# EAGLE schematic Low.Noise.Current.Source.bkup (EAGLE 7.2.0)

## Sheet 1 of 3
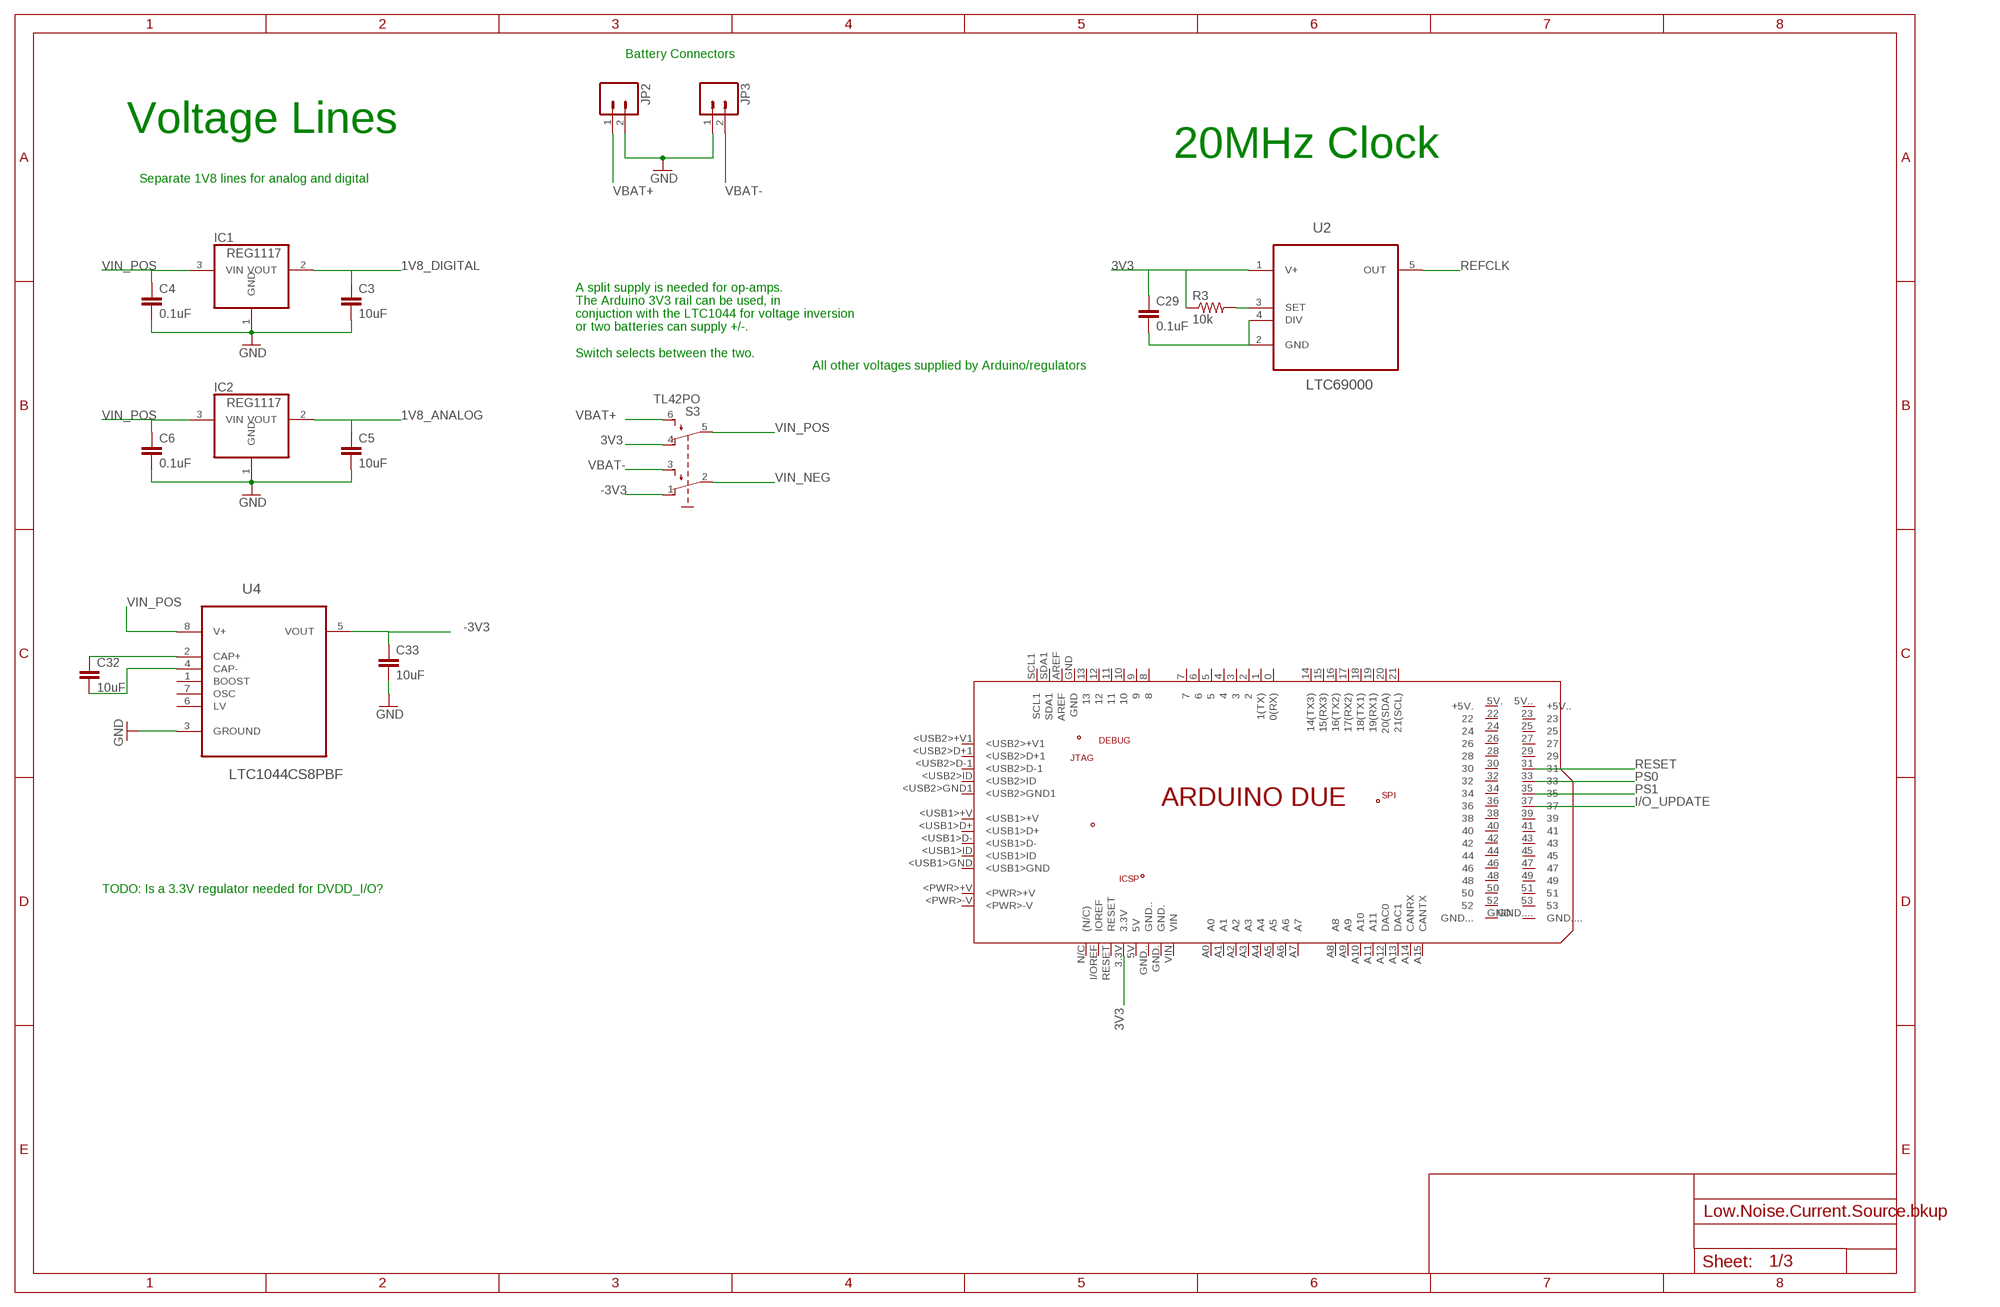
[diagram p0: schematic, sheet 1]

### Parts
C3  10uF  C-EUC0805  [C0805]
C4  0.1uF  C-EUC0805  [C0805]
C5  10uF  C-EUC0805  [C0805]
C6  0.1uF  C-EUC0805  [C0805]
C29  0.1uF  C-EUC0805  [C0805]
C32  10uF  C-EUC0805  [C0805]
C33  10uF  C-EUC0805  [C0805]
IC1  REG1117  [SOT223]
IC2  REG1117  [SOT223]
JP2  M02-JST-2MM-SMT  [JST-2-SMD]
JP3  M02-JST-2MM-SMT  [JST-2-SMD]
PCB1  ARDUINO_DUE  [ARDUINO_DUE]
R3  10k  R-US_R0805  [R0805]
S3  TL42PO  [TL4XPO]
U2  LTC69000  [SOT23-5L]
U4  LTC1044CS8PBF  [SOIC127P600X175-8N]

### Nets
1V8_ANALOG: C5.1 IC2.2(VOUT) ; also sheet 2
1V8_DIGITAL: C3.1 IC1.2(VOUT) ; also sheet 2
3V3: C29.1 PCB1.3.3V R3.1 U2.1(V+) ; also sheet 2
-3V3: C33.1 U4.5(VOUT)
GND: C3.2 C4.2 C5.2 C6.2 C33.2 IC1.1(GND) IC2.1(GND) JP2.2 JP3.1 U4.3(GROUND) ; also sheet 2,3
N$3: C29.2 U2.2(GND) U2.4(DIV)
N$12: C32.1 U4.2(CAP+)
N$13: R3.2 U2.3(SET)
N$14: C32.2 U4.4(CAP-)
REFCLK: U2.5(OUT) ; also sheet 2
VBAT+: JP2.1
VBAT-: JP3.2
VIN_POS: C4.1 C6.1 IC1.3(VIN) IC2.3(VIN) U4.8(V+)
Unconnected: PCB1.0(0(RX)) PCB1.1(1(TX)) PCB1.2 PCB1.3 PCB1.4 PCB1.5 PCB1.5V PCB1.5V.(+5V.) PCB1.5V..(+5V..) PCB1.6 PCB1.7 PCB1.8 PCB1.9 PCB1.10 PCB1.11 PCB1.12 PCB1.13 PCB1.14(14(TX3)) PCB1.15(15(RX3)) PCB1.16(16(TX2)) PCB1.17(17(RX2)) PCB1.18(18(TX1)) PCB1.19(19(RX1)) PCB1.20(20(SDA)) PCB1.21(21(SCL)) PCB1.22 PCB1.23 PCB1.24 PCB1.25 PCB1.26 PCB1.27 PCB1.28 PCB1.29 PCB1.30 PCB1.31 PCB1.32 PCB1.33 PCB1.34 PCB1.35 PCB1.36 PCB1.37 PCB1.38 PCB1.39 PCB1.40 PCB1.41 PCB1.42 PCB1.43 PCB1.44 PCB1.45 PCB1.46 PCB1.47 PCB1.48 PCB1.49 PCB1.50 PCB1.51 PCB1.52 PCB1.53 PCB1.+3.3V PCB1.+5V PCB1.+5V_ PCB1.<PWR>+V PCB1.<PWR>-V PCB1.<USB1>+V PCB1.<USB1>D+ PCB1.<USB1>D- PCB1.<USB1>GND PCB1.<USB1>ID PCB1.<USB2>+V1 PCB1.<USB2>D+1 PCB1.<USB2>D-1 PCB1.<USB2>GND1 PCB1.<USB2>ID PCB1.A0 PCB1.A1 PCB1.A2 PCB1.A3 PCB1.A4 PCB1.A5 PCB1.A6 PCB1.A7 PCB1.A8 PCB1.A9 PCB1.A10 PCB1.A11 PCB1.A12(DAC0) PCB1.A13(DAC1) PCB1.A14(CANRX) PCB1.A15(CANTX) PCB1.AREF PCB1.GND PCB1.GND1 PCB1.GND1. PCB1.GND1.. PCB1.GND1... PCB1.GND. PCB1.GND.. PCB1.GND... PCB1.GND.... PCB1.GND_ PCB1.GND__ PCB1.I/OREF(IOREF) PCB1.MISO PCB1.MISO2 PCB1.MOSI PCB1.MOSI2 PCB1.N/C((N/C)) PCB1.N/C. PCB1.RESET PCB1.RESET2 PCB1.RESET. PCB1.RESET.. PCB1.RESET_ PCB1.SCK PCB1.SCK2 PCB1.SCL1 PCB1.SDA1 PCB1.SWCLK PCB1.SWDIO PCB1.TCK PCB1.TDI PCB1.TDO PCB1.TMS PCB1.VIN S3.1(O) S3.2(P) S3.3(S) S3.4(O1) S3.5(P1) S3.6(S1) U4.1(BOOST) U4.6(LV) U4.7(OSC)

### Notes on the sheet
- Battery Connectors
- Voltage Lines
- 20MHz Clock
- Separate 1V8 lines for analog and digital
- A split supply is needed for op-amps.
  The Arduino 3V3 rail can be used, in 
  conjuction with the LTC1044 for voltage inversion
  or two batteries can supply +/-.
  
  Switch selects between the two.
- All other voltages supplied by Arduino/regulators
- TODO: Is a 3.3V regulator needed for DVDD_I/O?

## Sheet 2 of 3: AD9954
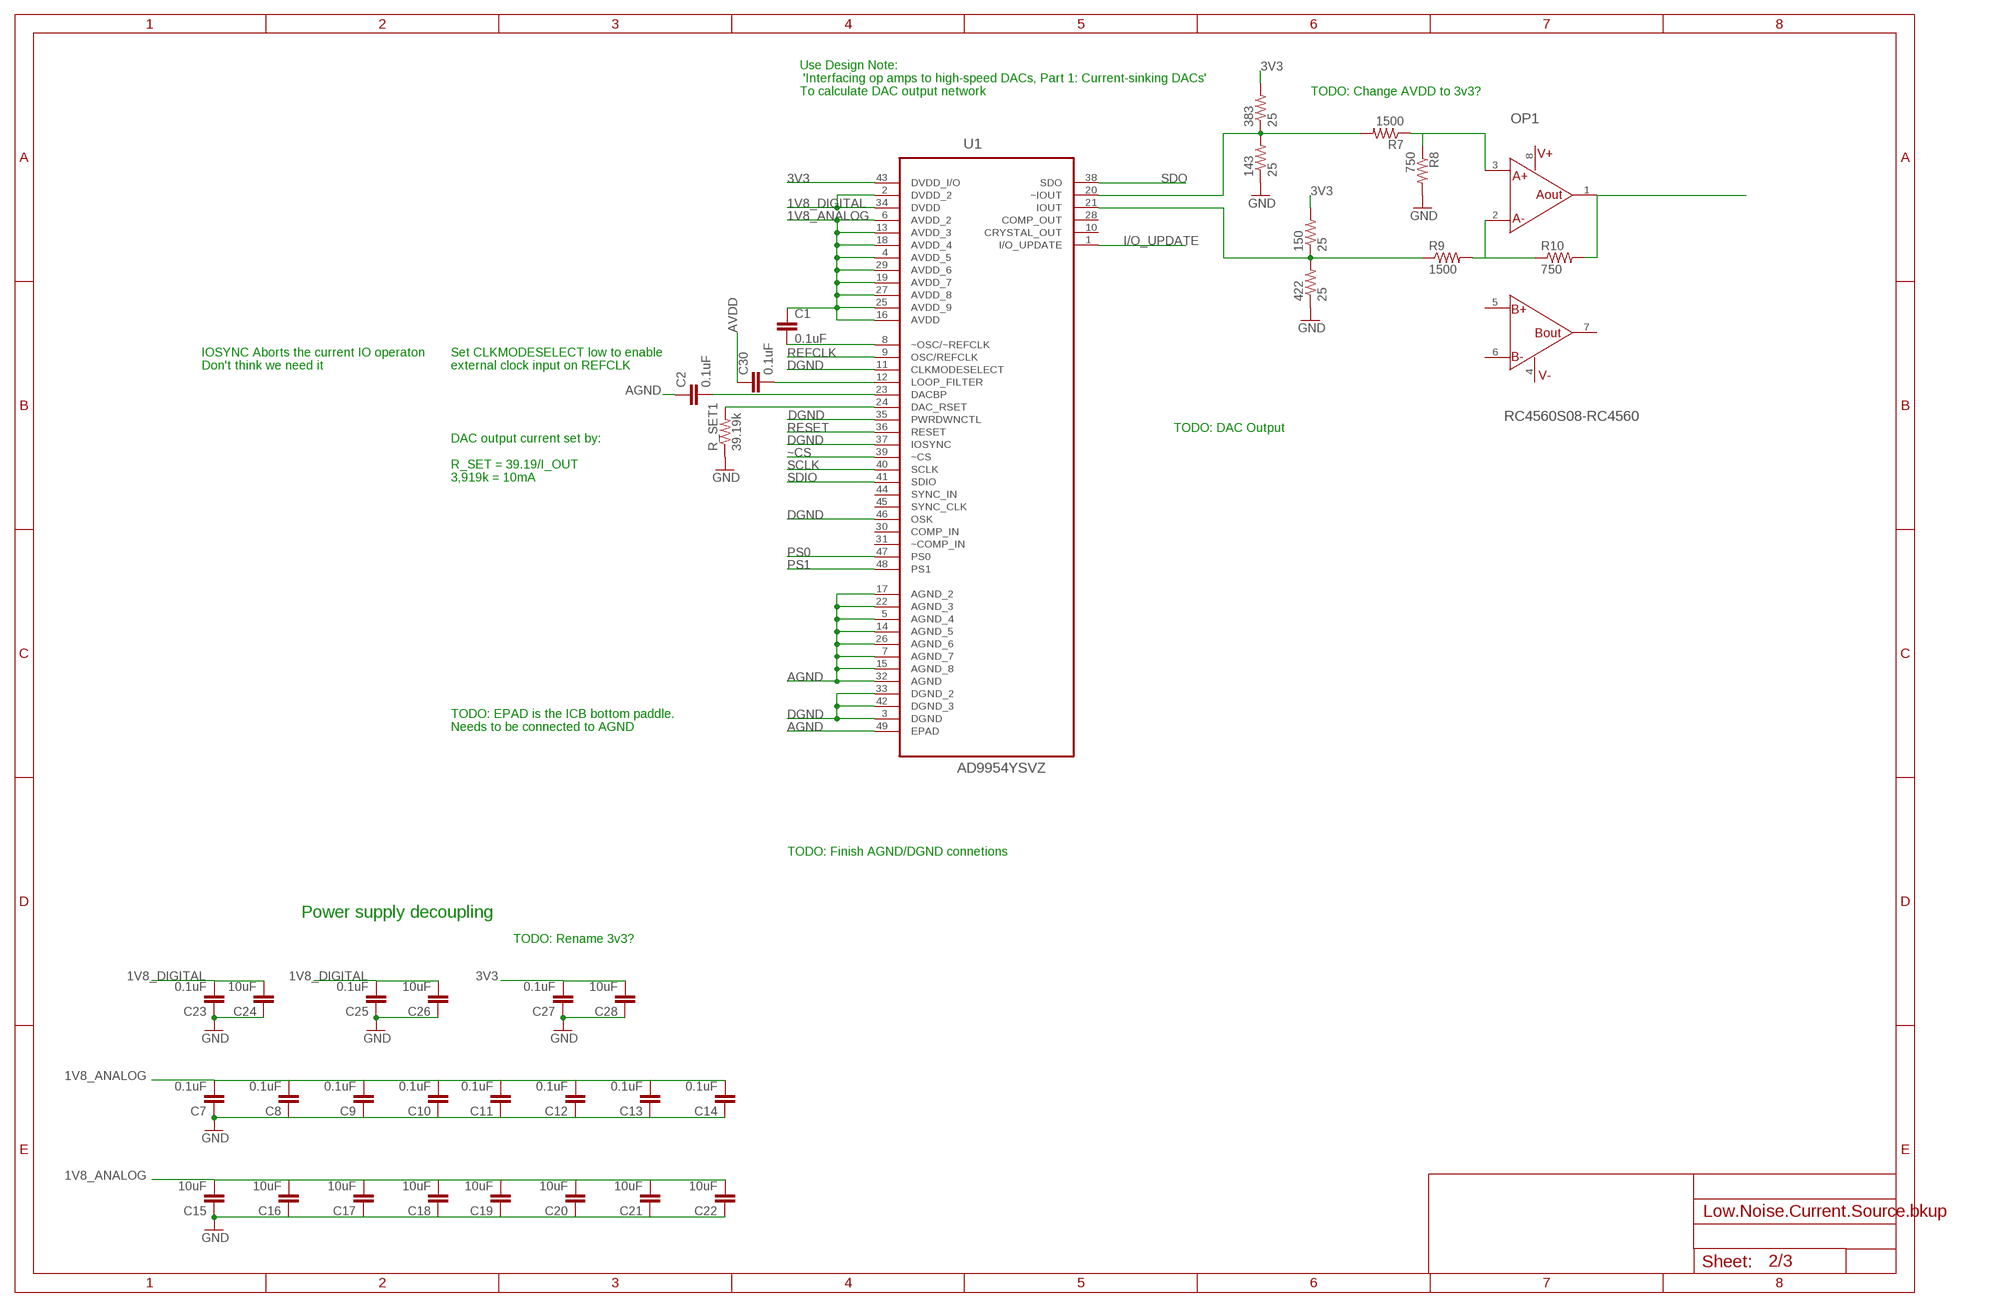
[diagram p1: schematic, sheet 2]

### Parts
143  25  R-US_R0805  [R0805]
150  25  R-US_R0805  [R0805]
383  25  R-US_R0805  [R0805]
422  25  R-US_R0805  [R0805]
C1  0.1uF  C-EUC0805  [C0805]
C2  0.1uF  C-EUC0805  [C0805]
C7  0.1uF  C-EUC0805  [C0805]
C8  0.1uF  C-EUC0805  [C0805]
C9  0.1uF  C-EUC0805  [C0805]
C10  0.1uF  C-EUC0805  [C0805]
C11  0.1uF  C-EUC0805  [C0805]
C12  0.1uF  C-EUC0805  [C0805]
C13  0.1uF  C-EUC0805  [C0805]
C14  0.1uF  C-EUC0805  [C0805]
C15  10uF  C-EUC0805  [C0805]
C16  10uF  C-EUC0805  [C0805]
C17  10uF  C-EUC0805  [C0805]
C18  10uF  C-EUC0805  [C0805]
C19  10uF  C-EUC0805  [C0805]
C20  10uF  C-EUC0805  [C0805]
C21  10uF  C-EUC0805  [C0805]
C22  10uF  C-EUC0805  [C0805]
C23  0.1uF  C-EUC0805  [C0805]
C24  10uF  C-EUC0805  [C0805]
C25  0.1uF  C-EUC0805  [C0805]
C26  10uF  C-EUC0805  [C0805]
C27  0.1uF  C-EUC0805  [C0805]
C28  10uF  C-EUC0805  [C0805]
C30  0.1uF  C-EUC0805  [C0805]
OP1  RC4560S08-RC4560  [SO8]
R7  1500  R-US_R0805  [R0805]
R8  750  R-US_R0805  [R0805]
R9  1500  R-US_R0805  [R0805]
R10  750  R-US_R0805  [R0805]
R_SET1  39.19k  R-US_R0805  [R0805]
U1  AD9954YSVZ  [QFP50P900X900X120-49N]

### Nets
1V8_ANALOG: C1.1 C7.2 C8.2 C9.2 C10.2 C11.2 C12.2 C13.2 C14.2 C15.2 C16.2 C17.2 C18.2 C19.2 C20.2 C21.2 C22.2 U1.4(AVDD_5) U1.6(AVDD_2) U1.13(AVDD_3) U1.16(AVDD) U1.18(AVDD_4) U1.19(AVDD_7) U1.25(AVDD_9) U1.27(AVDD_8) U1.29(AVDD_6) ; also sheet 1
1V8_DIGITAL: C23.2 C24.2 C25.2 C26.2 U1.2(DVDD_2) U1.34(DVDD) ; also sheet 1
3V3: 150.2 383.2 C27.2 C28.2 U1.43(DVDD_I/O) ; also sheet 1
AGND: C2.1 U1.5(AGND_4) U1.7(AGND_7) U1.14(AGND_5) U1.15(AGND_8) U1.17(AGND_2) U1.22(AGND_3) U1.26(AGND_6) U1.32(AGND) U1.49(EPAD)
AVDD: C30.1
DGND: U1.3(DGND) U1.11(CLKMODESELECT) U1.33(DGND_2) U1.35(PWRDWNCTL) U1.37(IOSYNC) U1.42(DGND_3) U1.46(OSK)
GND: 143.1 422.1 C7.1 C8.1 C9.1 C10.1 C11.1 C12.1 C13.1 C14.1 C15.1 C16.1 C17.1 C18.1 C19.1 C20.1 C21.1 C22.1 C23.1 C24.1 C25.1 C26.1 C27.1 C28.1 R8.2 R_SET1.1 ; also sheet 1,3
I/O_UPDATE: U1.1(I/O_UPDATE) ; also sheet 1
IOUT: 150.1 422.2 R9.1 U1.21(IOUT)
N$1: C2.2 U1.23(DACBP)
N$2: C1.2 U1.8(~OSC/~REFCLK)
N$4: R_SET1.2 U1.24(DAC_RSET)
N$5: OP1.3(POSA) R7.1 R8.1
N$7: OP1.2(NEGA) R9.2 R10.1
N$9: OP1.1(OUTA) R10.2
N$10: C30.2 U1.12(LOOP_FILTER)
PS0: U1.47(PS0) ; also sheet 1
PS1: U1.48(PS1) ; also sheet 1
REFCLK: U1.9(OSC/REFCLK) ; also sheet 1
RESET: U1.36(RESET) ; also sheet 1
SCLK: U1.40(SCLK)
SDIO: U1.41(SDIO)
SDO: U1.38(SDO)
~CS: U1.39(~CS)
~IOUT: 143.2 383.1 R7.2 U1.20(~IOUT)
Unconnected: OP1.5(POSB) OP1.6(NEGB) OP1.7(OUTB) U1.10(CRYSTAL_OUT) U1.28(COMP_OUT) U1.30(COMP_IN) U1.31(~COMP_IN) U1.44(SYNC_IN) U1.45(SYNC_CLK)

### Notes on the sheet
- Use Design Note:
   'Interfacing op amps to high-speed DACs, Part 1: Current-sinking DACs' 
  To calculate DAC output network
- TODO: Change AVDD to 3v3?
- IOSYNC Aborts the current IO operaton
  Don't think we need it
- Set CLKMODESELECT low to enable
  external clock input on REFCLK
- TODO: DAC Output
- DAC output current set by:
  
  R_SET = 39.19/I_OUT
  3,919k = 10mA
- TODO: EPAD is the ICB bottom paddle.
  Needs to be connected to AGND
- TODO: Finish AGND/DGND connetions
- Power supply decoupling
- TODO: Rename 3v3?

## Sheet 3 of 3
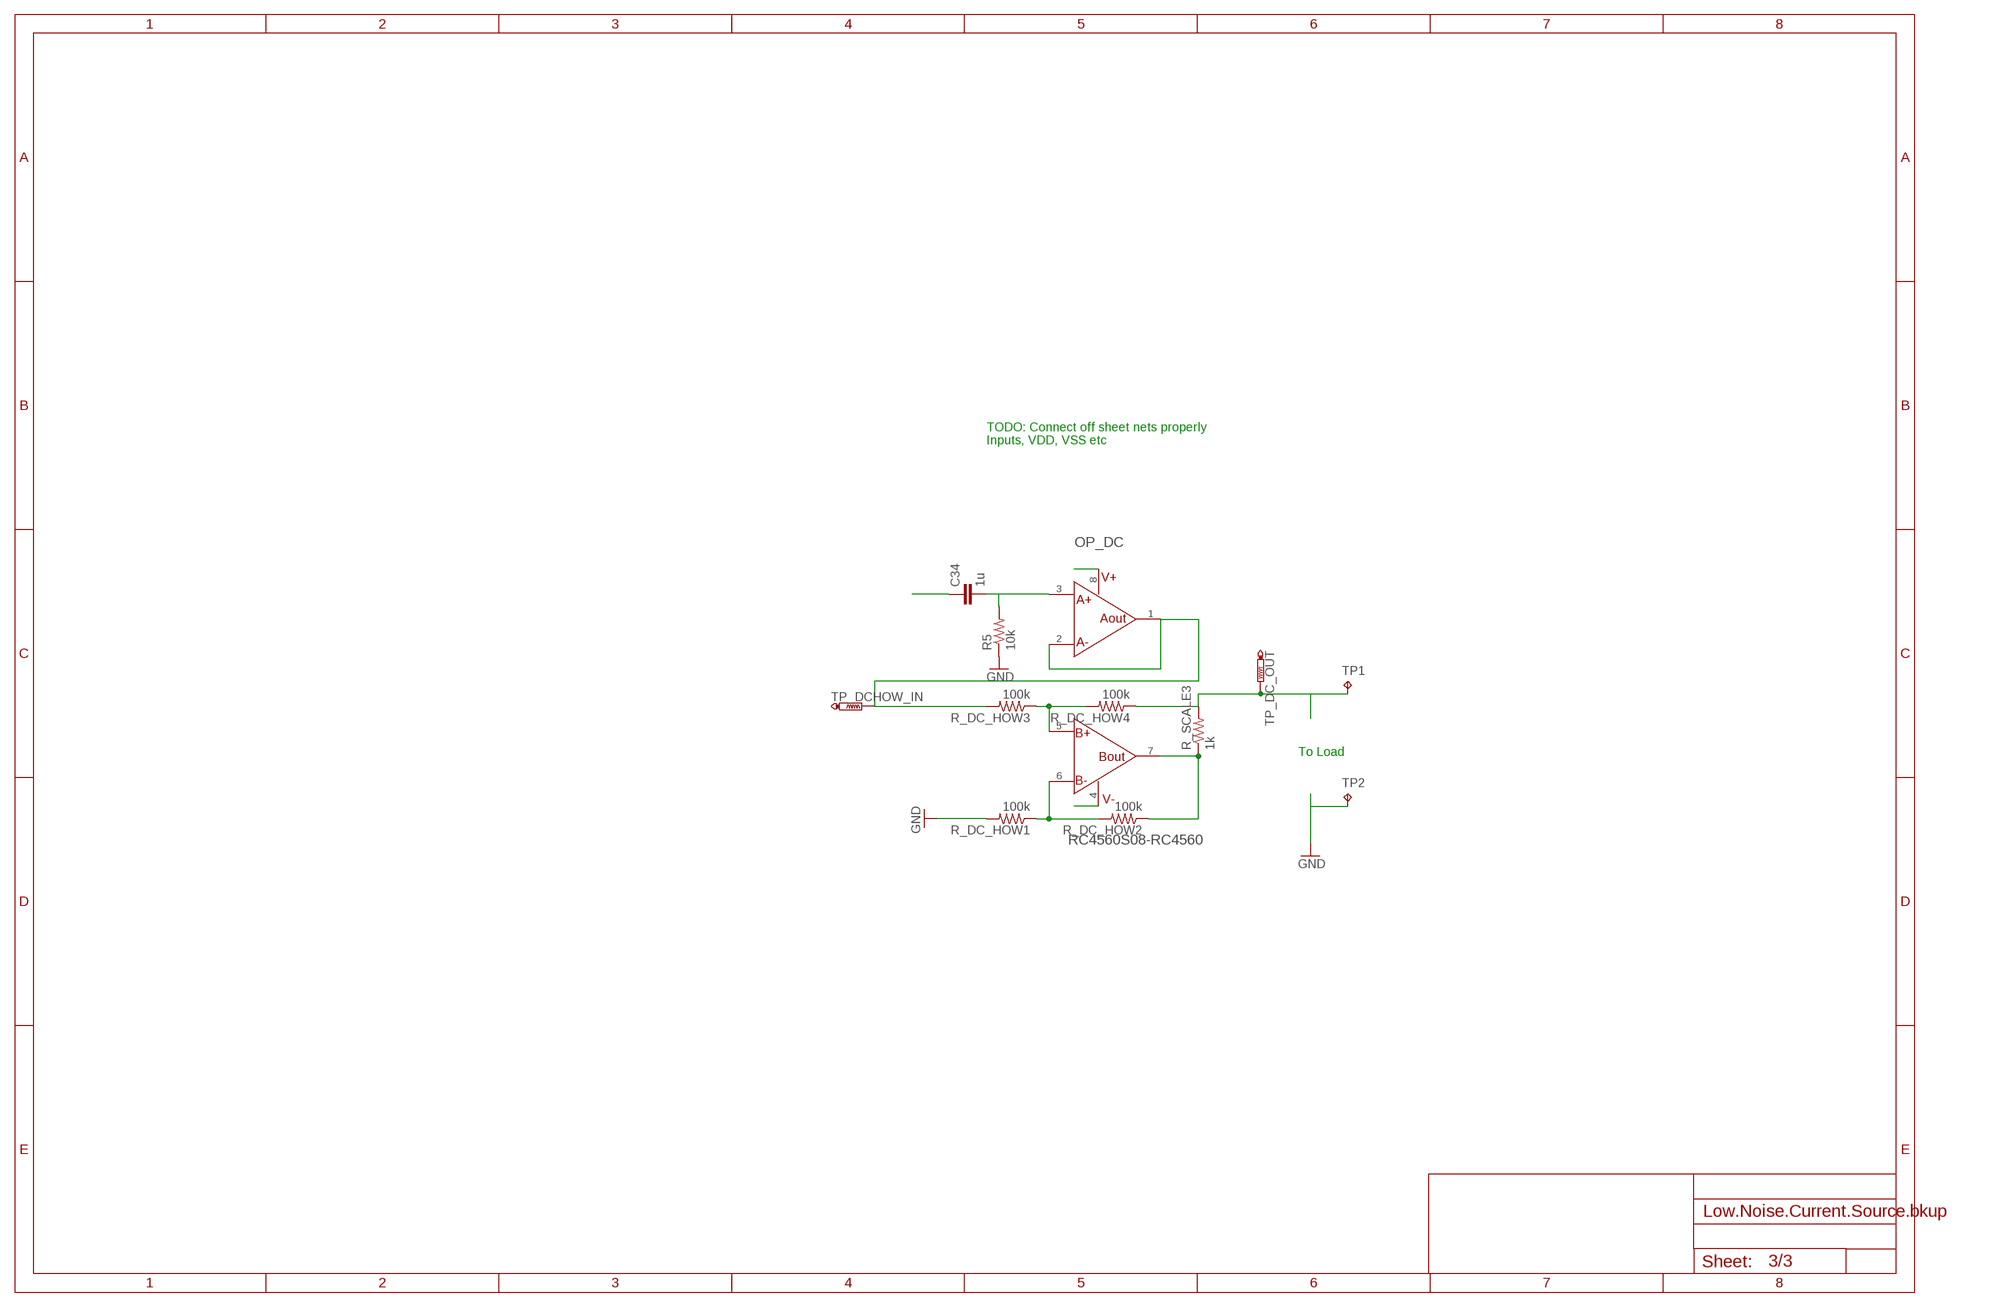
[diagram p2: schematic, sheet 3]

### Parts
C34  1u  C-EUC0805  [C0805]
OP_DC  RC4560S08-RC4560  [SO8]
R5  10k  R-US_R0805  [R0805]
R_DC_HOW1  100k  R-US_R0805  [R0805]
R_DC_HOW2  100k  R-US_R0805  [R0805]
R_DC_HOW3  100k  R-US_R0805  [R0805]
R_DC_HOW4  100k  R-US_R0805  [R0805]
R_SCALE3  1k  R-US_R0805  [R0805]
TP1  TPPAD1-20  [P1-20]
TP2  TPPAD1-20  [P1-20]
TP_DC_OUT  PTR1PAD1-13  [P1-13]
TP_DCHOW_IN  PTR1PAD1-13  [P1-13]

### Nets
GND: R5.1 R_DC_HOW1.2 TP2.TP ; also sheet 1,2
HOW_INPUT: OP_DC.1(OUTA) OP_DC.2(NEGA) R_DC_HOW3.2 TP_DCHOW_IN.TP
N$15: OP_DC.6(NEGB) R_DC_HOW1.1 R_DC_HOW2.2
N$16: C34.2 OP_DC.3(POSA) R5.2
N$17: C34.1
N$19: OP_DC.7(OUTB) R_DC_HOW2.1 R_SCALE3.1
N$25: R_DC_HOW4.1 R_SCALE3.2 TP1.TP TP_DC_OUT.TP
N$26: OP_DC.5(POSB) R_DC_HOW3.1 R_DC_HOW4.2
VDD: OP_DC.8(V+)
VSS: OP_DC.4(V-)

### Notes on the sheet
- TODO: Connect off sheet nets properly
  Inputs, VDD, VSS etc
- To Load

## Power pins joined to a net without a drawn wire
V+: OP1.8(V+)
V-: OP1.4(V-)

## Library data of the parts
143 150 383 422 R3 R5 R7-R10 R_SET1 = adafruit:R-US_: RESISTOR, American symbol
C1 C2 C7-C28 C30 C34 = resistor:C-EU: CAPACITOR, European symbol
C3-C6 C29 C32 C33 = rcl:C-EU: CAPACITOR, European symbol
IC1 IC2 = burr-brown:REG1117: 800mA and 1A Low Dropout (LDO) Positive Regulator 1.8V, 2.5V, 2.85V, 3.3V, 5V, and Adj; MPN: REG1117; OC_FARNELL: 1097566; OC_NEWARK: 14P6981
JP2 JP3 = SwitchBoard:M02: Header 2 Standard 2-pin 0.1" header. Use with straight break away headers (SKU : PRT-00116), right angle break away headers (PRT-00553), swiss pins (PRT-00743), machine pins (PRT-00117), and female headers (PRT-00115). Molex polarized connector foot print use with SKU : PRT-08233 with associated crimp pins and housings.
OP1 OP_DC = RC4560:RC4560: RC4560 Op-Amp Texas Instruments
PCB1 = E14_Arduino_revC:ARDUINO_DUE: Device for representing an Arduino Due board with a footprint in an EAGLE design. Created by Dave Young for Element14. More EAGLE documentation at: http://www.element14.com/community/community/knode/cadsoft_eagle
R_DC_HOW1-R_DC_HOW4 R_SCALE3 = rcl:R-US_: RESISTOR, American symbol
S3 = switch:TL42PO: TINY SWITCH ON - MOM Source: http://www2.produktinfo.conrad.com/datenblaetter/700000-724999/705152-da-01-de-Subminiaturschalter_TL_36YO.pdf
TP1 TP2 = testpad:TP: Test pad
TP_DC_OUT TP_DCHOW_IN = testpad:PTR1: TEST PIN
U1 = AD9954:AD9954YSVZ: Direct Digital Synthesizer; MPN: AD9954YSVZ; OC_FARNELL: 1581969; OC_NEWARK: 19M8953; PACKAGE: TQFP-48; SUPPLIER: ANALOG DEVICES
U2 = LTC6900:LTC69000: Low Power, 1kHz to 20MHz Resistor Set SOT-23 Oscillator
U4 = LTC_By_element14_Batch_1:LTC1044CS8PBF: Switched Capacitor Voltage Converter; MPN: LTC1044CS8#PBF; OC_FARNELL: 1663593; OC_NEWARK: 55M8900; PACKAGE: SOIC-8; SUPPLIER: Linear Technology